# Altium schematic sheet driver_V1.4.SchDoc
size A4
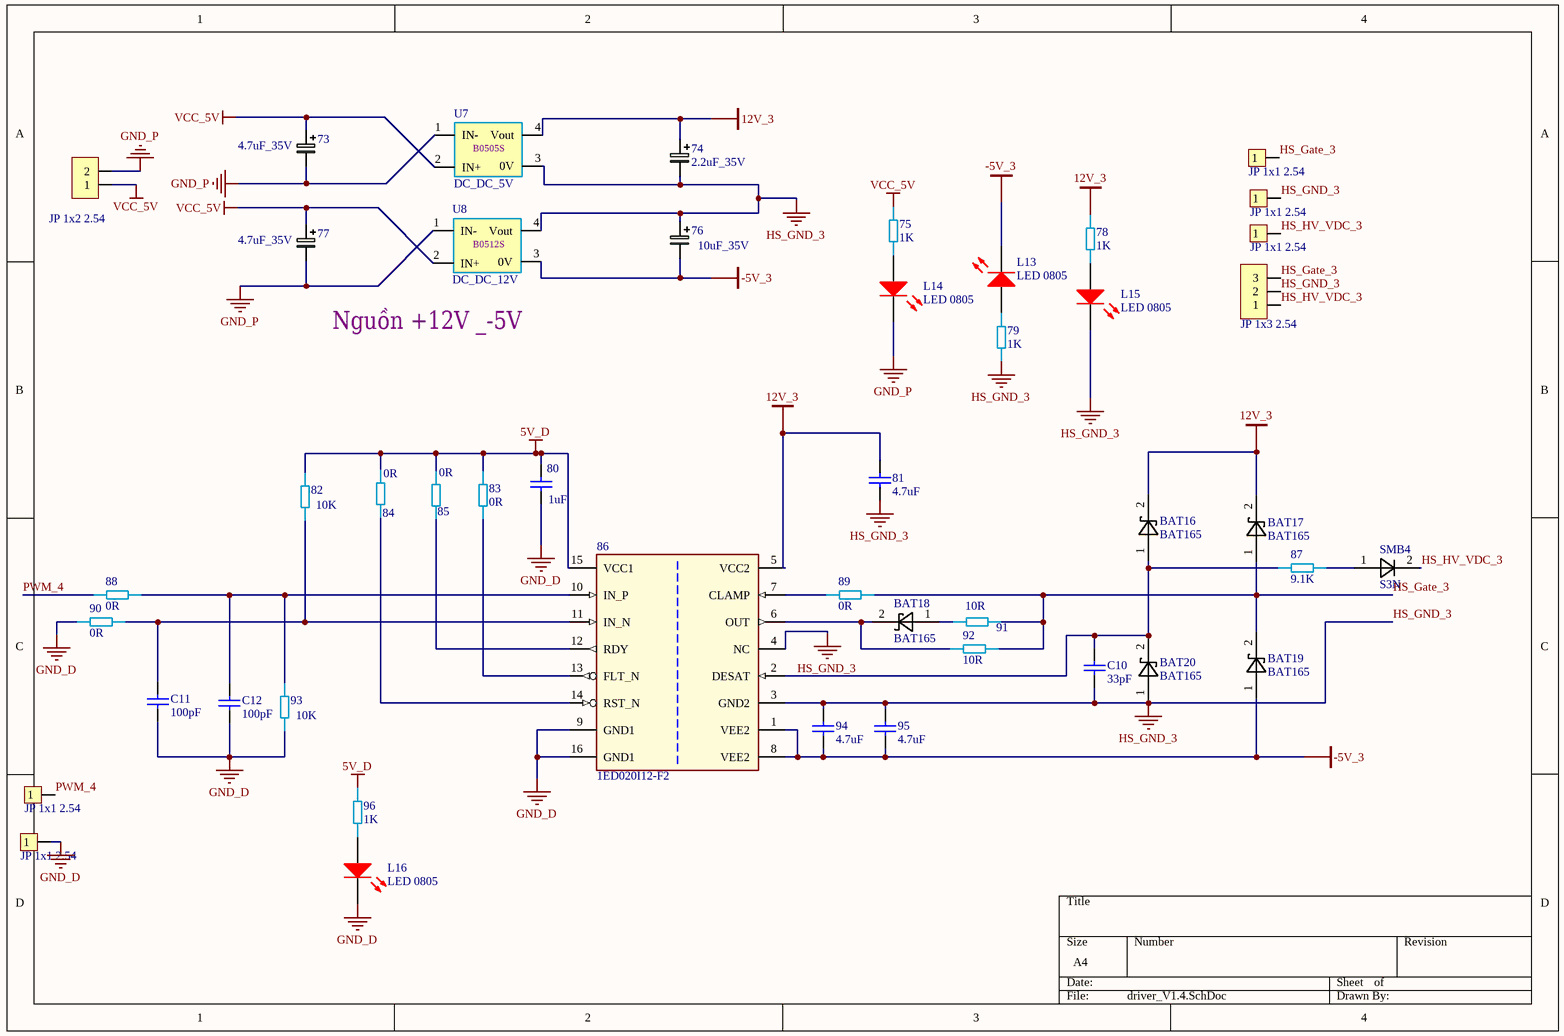
[diagram p0: driver_V1.4.SchDoc]

## Parts
73  4.7uF_35V  [tu_4x5.4mm]
74  2.2uF_35V  [tu_4x5.4mm]
75  1K  [RES1206]
76  10uF_35V  [tu_4x5.4mm]
77  4.7uF_35V  [tu_4x5.4mm]
78  1K  [RES1206]
79  1K  [RES1206]
80  1uF  [Tu 0805_N]
81  4.7uF  [tu 1206_N]
82  10K  [RES1206]
83  0R  [RES1206]
84  0R  [RES1206]
85  0R  [RES1206]
86  1ED020I12-F2  [SOIC127P1028X264-16N-1]
87  9.1K  [RES_2512]
88  0R  [RES1206]
89  0R  [RES_2512]
90  0R  [RES1206]
91  10R  [RES_2512]
92  10R  [RES_2512]
93  10K  [RES1206]
94  4.7uF  [tu 1206_N]
95  4.7uF  [tu 1206_N]
96  1K  [RES1206]
BAT16  BAT165  [SMB]
BAT17  BAT165  [SMB]
BAT18  BAT165  [SMB]
BAT19  BAT165  [SMB]
BAT20  BAT165  [SMB]
C10  33pF  [Tu 0805_N]
C11  100pF  [Tu 0805_N]
C12  100pF  [Tu 0805_N]
JP23  JP 1x1 2.54  [test_point]
JP24  JP 1x2 2.54  [JP 1x2 DT_n]
JP25  JP 1x1 2.54  [test_point]
JP26  JP 1x1 2.54  [test_point]
JP27  JP 1x3 2.54  [XH2.54M-3]
JP28  JP 1x1 2.54  [test_point]
JP29  JP 1x1 2.54  [test_point]
L13  LED 0805  [LED-0805-Red]
L14  LED 0805  [LED-0805-Red]
L15  LED 0805  [LED-0805-Red]
L16  LED 0805  [LED-0805-Red]
SMB4  S3N  [SMB]
U7  DC_DC_5V  [B0505S/D-1W]
U8  DC_DC_12V  [B0512S/D-1W]

## Nets
5V_D: 80.2 82.2 83.1 84.2 85.1 86.15(VCC1) 96.1
12V_3: 74.1 78.1 81.2 86.5(VCC2) BAT16.2 BAT17.2 U7.4(Vout)
-5V_3: 76.2 86.1(VEE2) 86.8(VEE2) 94.1 95.1 BAT19.1 L13.2(K) U8.3(0V)
GND_D: 80.1 86.9(GND1) 86.16(GND1) 90.2 93.1 C11.1 C12.1 JP29.1 L16.2(K)
GND_P: 73.2 77.2 JP24.2 L14.2(K) U7.1(IN-) U8.1(IN-)
HS_GND_3: 74.2 76.1 79.2 81.1 86.3(GND2) 86.4(NC) 94.2 95.2 BAT20.1 C10.1 JP25.1 JP27.2 L15.2(K) U7.3(0V) U8.4(Vout)
VCC_5V: 73.1 75.1 77.1 JP24.1 U7.2(IN+) U8.2(IN+)
HS_Gate_3: 89.2 91.2 92.2 BAT17.1 BAT19.2 JP23.1 JP27.3
HS_HV_VDC_3: JP26.1 JP27.1 SMB4.2
PWM_4: 88.2 JP28.1
Net75_2: 75.2 L14.1(A)
Net78_2: 78.2 L15.1(A)
Net79_1: 79.1 L13.1(A)
Net82_1: 82.1 86.11(IN_N) 90.1 C11.2
Net83_2: 83.2 86.13(FLT_N)
Net84_1: 84.1 86.14(RST_N)
Net85_2: 85.2 86.12(RDY)
Net86_2: 86.2(DESAT) 87.1 BAT16.1 BAT20.2 C10.2
Net86_6: 86.6(OUT) 92.1 BAT18.2
Net86_7: 86.7(CLAMP) 89.1
Net86_10: 86.10(IN_P) 88.1 93.2 C12.2
Net87_2: 87.2 SMB4.1
Net91_1: 91.1 BAT18.1
Net96_2: 96.2 L16.1(A)

## Notes on the sheet
- Nguồn +12V _-5V
- (in symbol DC_DC_5v) B0505S
- (in symbol DC_DC_12v) B0512S

## Library data of the parts
73 74 76 77 = capacitor_electric
75 78 79 82-85 87-93 96 = 311-0.0GRTR-ND
80 C10-C12 = cap_0805
81 94 95 = cap_1210
86 = 1ED020I12-F2: Single IGBT Driver IC; Manufacturer: Infineon Technologies; Manufacturer Order Number: 1ED020I12-F2; PackageReference: PG-DSO-16-15
JP23 JP25 JP26 JP28 JP29 = JP 1x1 2.54 Duc Thang: Cắm; Ten_Linh_Kien: Jump Đơn Đực 2.54MM 1x40P Thẳng 11MM; Don_Vi: Con; Ma_Hang: MH000903; Ghi_Chu: *; Kieu_Chan: *; Chung_Loai: Cắm
JP24 = JP 1x2 2.54 Duc Thang: Cắm; Ten_Linh_Kien: Jump Đơn Đực 2.54MM 1x40P Thẳng 11MM; Don_Vi: Con; Ma_Hang: MH000903; Ghi_Chu: *; Kieu_Chan: *; Chung_Loai: Cắm
JP27 = JP 1x3 2.54 Duc Cong: Cắm; Ten_Linh_Kien: Jump Đơn Đực 2.54MM 1x40P Cong Đứng; Don_Vi: Con; Ma_Hang: MH000904; Ghi_Chu: *; Kieu_Chan: *; Chung_Loai: Cắm
L13-L16 = LED 0805 Do: Dán; Don_Vi: Con; Ma_Hang: MH000897; Ten_Linh_Kien: LED 0805 Màu Đỏ (Red); Ghi_Chu: *; Kieu_Chan: *; Chung_Loai: Dán
SMB4 = S3A-S3N